# Altium schematic sheet Transmitter.SchDoc
size B; SheetNumber: 1; SheetTotal: 2
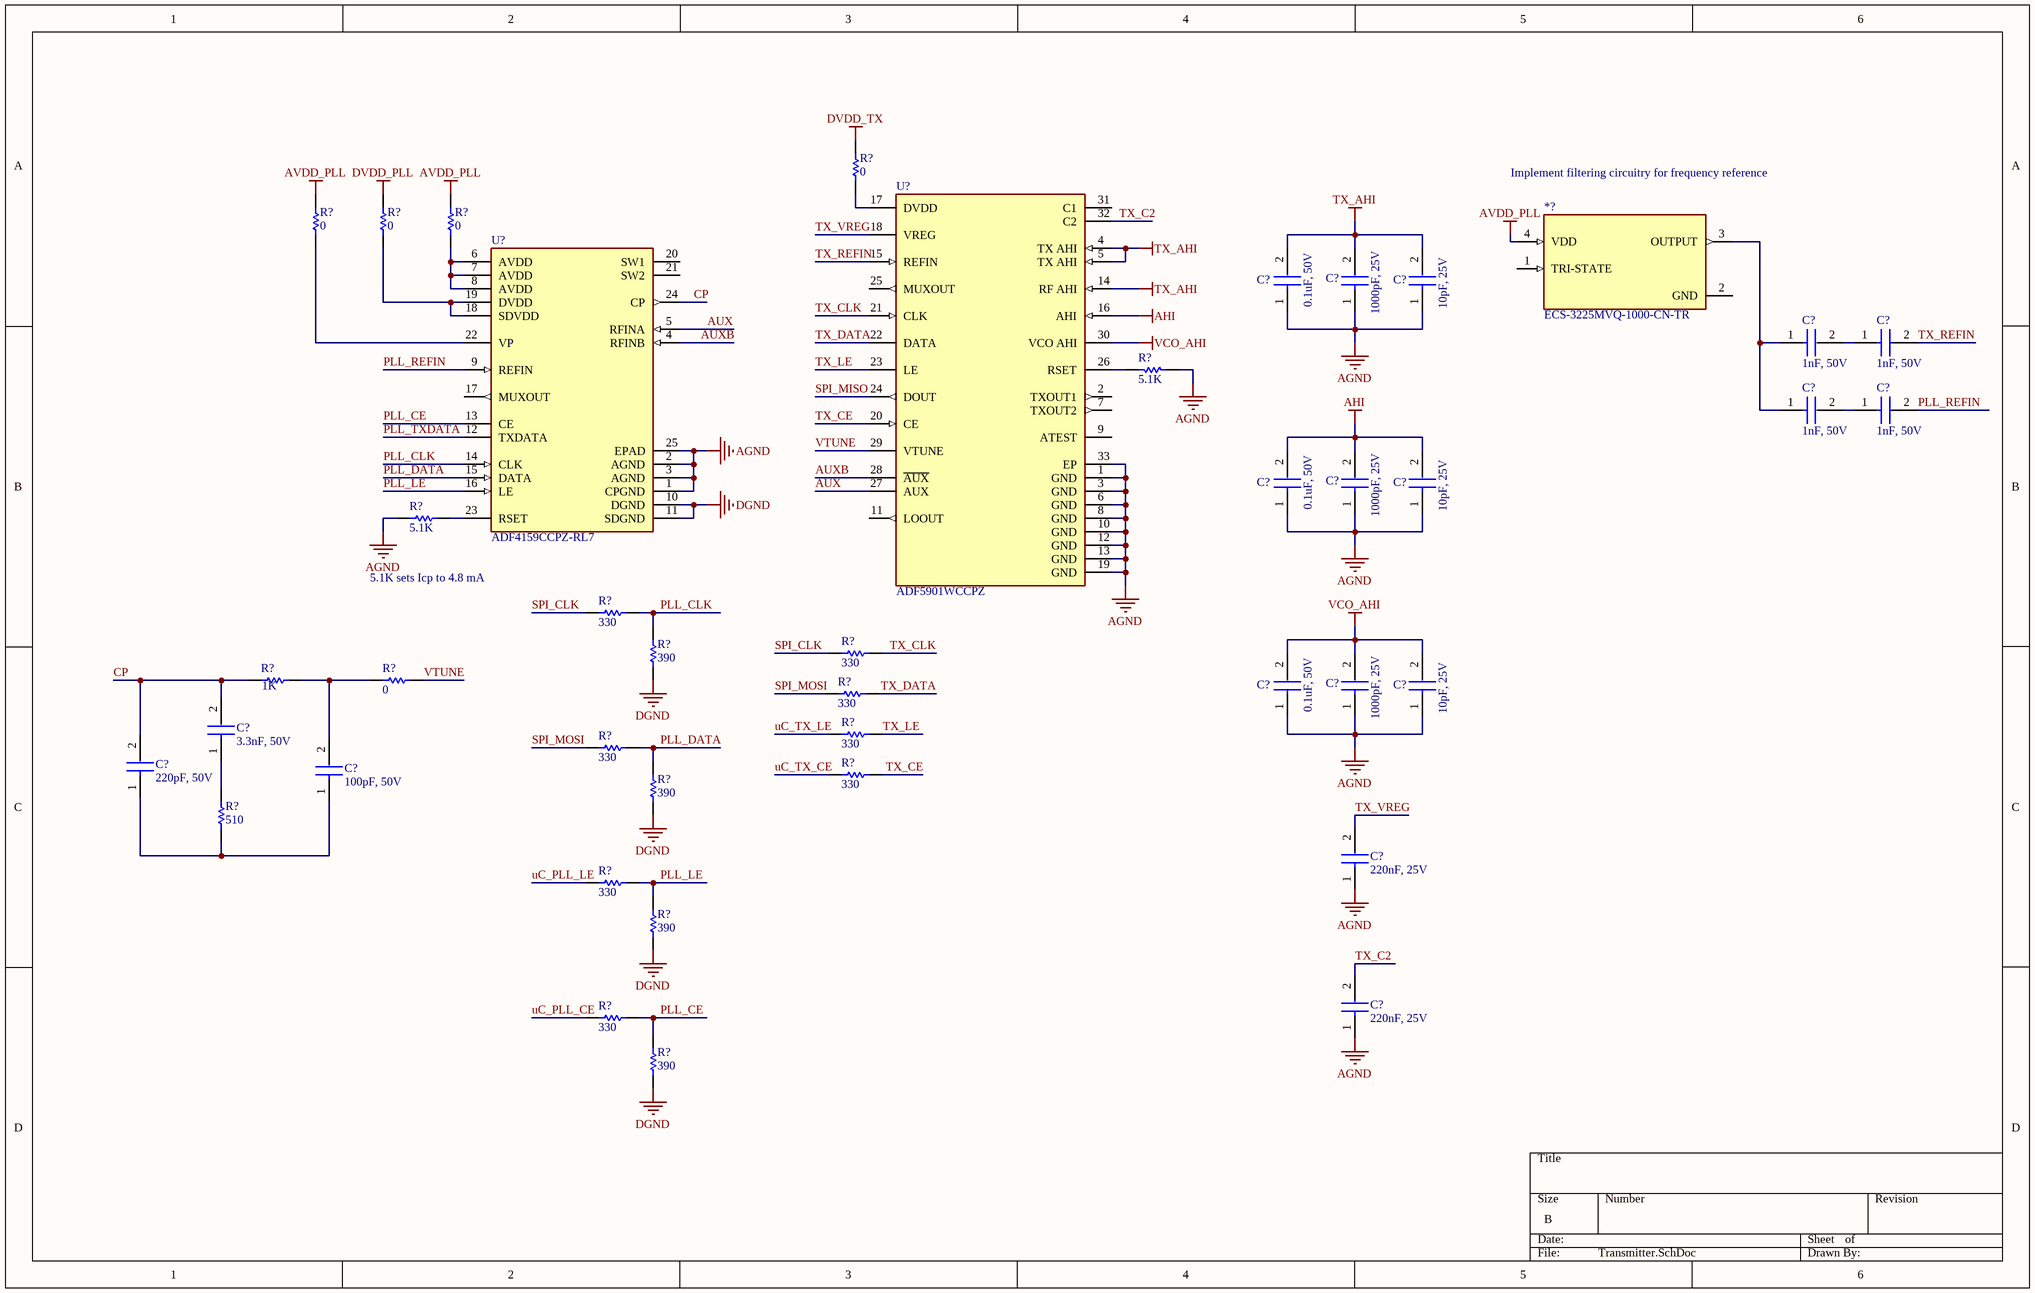
[diagram p0: Transmitter.SchDoc]

## Parts
(Parts that share a designator on the sheet are numbered #1, #2 ... from top to bottom, then left to right.)
*?  ECS-3225MVQ-1000-CN-TR  [OSC_ECS-3225MVQ-1000-CN-TR]
C?#1  0.1uF, 50V  [CAP_CC0603_YAG-M]
C?#2  1000pF, 25V  [FP-0402-L_1_0_1-W_0_5_0_1-IPC_C]
C?#3  10pF, 25V  [CAPC1005X56X25NL10T15]
C?#4  1nF, 50V  [FP-0603-L_1_6_0_15-W_0_81-IPC_C]
C?#5  1nF, 50V  [FP-0603-L_1_6_0_15-W_0_81-IPC_C]
C?#6  1nF, 50V  [FP-0603-L_1_6_0_15-W_0_81-IPC_C]
C?#7  1nF, 50V  [FP-0603-L_1_6_0_15-W_0_81-IPC_C]
C?#8  0.1uF, 50V  [CAP_CC0603_YAG-M]
C?#9  1000pF, 25V  [FP-0402-L_1_0_1-W_0_5_0_1-IPC_C]
C?#10  10pF, 25V  [CAPC1005X56X25NL10T15]
C?#11  0.1uF, 50V  [CAP_CC0603_YAG-M]
C?#12  1000pF, 25V  [FP-0402-L_1_0_1-W_0_5_0_1-IPC_C]
C?#13  10pF, 25V  [CAPC1005X56X25NL10T15]
C?#14  3.3nF, 50V  [CAPC2012X88N]
C?#15  220pF, 50V  [CAPC2012X88N]
C?#16  100pF, 50V  [CAPC2012X88N]
C?#17  220nF, 25V  [FP-0603-L_1_6_0_15-W_0_81-IPC_C]
C?#18  220nF, 25V  [FP-0603-L_1_6_0_15-W_0_81-IPC_C]
R?#1  0  [RESC1005X40X25ML05T05]
R?#2  0  [RESC1005X40X25ML05T05]
R?#3  0  [RESC1005X40X25ML05T05]
R?#4  0  [RESC1005X40X25ML05T05]
R?#5  value 5.1K  (hidden comment: Resistor)
R?#6  value 5.1K  (hidden comment: Resistor)
R?#7  330  [RESC1608X55N]
R?#8  330  [RESC1608X55N]
R?#9  1K  [RESC2012X60N]
R?#10  0  [RES_ERJ-6GEY0R00V]
R?#11  390  [RESC1608X55N]
R?#12  330  [RESC1608X55N]
R?#13  330  [RESC1608X55N]
R?#14  330  [RESC1608X55N]
R?#15  330  [RESC1608X55N]
R?#16  390  [RESC1608X55N]
R?#17  510  [RESC2012X60N]
R?#18  330  [RESC1608X55N]
R?#19  390  [RESC1608X55N]
R?#20  330  [RESC1608X55N]
R?#21  390  [RESC1608X55N]
U?#1  ADF5901WCCPZ
U?#2  ADF4159CCPZ-RL7

## Nets
AGND: C?#1.1 C?#2.1 C?#3.1 C?#8.1 C?#9.1 C?#10.1 C?#11.1 C?#12.1 C?#13.1 C?#17.1 C?#18.1 R?#5.1 R?#6.1 U?#1.1(GND) U?#1.3(GND) U?#1.6(GND) U?#1.8(GND) U?#1.10(GND) U?#1.12(GND) U?#1.13(GND) U?#1.19(GND) U?#1.33(EP) U?#2.1(CPGND) U?#2.2(AGND) U?#2.3(AGND) U?#2.25(EPAD)
AHI: C?#8.2 C?#9.2 C?#10.2 U?#1.16(AHI)
AVDD_PLL: *?.4(VDD) R?#2.2 R?#4.2
DGND: R?#11.1 R?#16.1 R?#19.1 R?#21.1 U?#2.10(DGND) U?#2.11(SDGND)
DVDD_PLL: R?#3.2
DVDD_TX: R?#1.2
TX_AHI: C?#1.2 C?#2.2 C?#3.2 U?#1.4(TX_AHI) U?#1.5(TX_AHI) U?#1.14(RF_AHI)
VCO_AHI: C?#11.2 C?#12.2 C?#13.2 U?#1.30(VCO_AHI)
AUX: U?#1.27(AUX) U?#2.5(RFINA)
AUXB: U?#1.28(~{AUX}) U?#2.4(RFINB)
CP: C?#14.2 C?#15.2 R?#9.1 U?#2.24(CP)
PLL_CE: R?#20.2 R?#21.2 U?#2.13(CE)
PLL_CLK: R?#7.2 R?#11.2 U?#2.14(CLK)
PLL_DATA: R?#14.2 R?#16.2 U?#2.15(DATA)
PLL_LE: R?#18.2 R?#19.2 U?#2.16(LE)
PLL_REFIN: C?#7.2 U?#2.9(REFIN)
PLL_TXDATA: U?#2.12(TXDATA)
SPI_CLK: R?#7.1 R?#8.1
SPI_MISO: U?#1.24(DOUT)
SPI_MOSI: R?#12.1 R?#14.1
TX_C2: C?#18.2 U?#1.32(C2)
TX_CE: R?#15.2 U?#1.20(CE)
TX_CLK: R?#8.2 U?#1.21(CLK)
TX_DATA: R?#12.2 U?#1.22(DATA)
TX_LE: R?#13.2 U?#1.23(LE)
TX_REFIN: C?#5.2 U?#1.15(REFIN)
TX_VREG: C?#17.2 U?#1.18(VREG)
uC_PLL_CE: R?#20.1
uC_PLL_LE: R?#18.1
uC_TX_CE: R?#15.1
uC_TX_LE: R?#13.1
VTUNE: R?#10.2 U?#1.29(VTUNE)
Net*?_3: *?.3(OUTPUT) C?#4.1 C?#6.1
NetC?#4_2: C?#4.2 C?#5.1
NetC?#6_2: C?#6.2 C?#7.1
NetC?#14_1: C?#14.1 R?#17.2
NetC?#15_1: C?#15.1 C?#16.1 R?#17.1
NetC?#16_2: C?#16.2 R?#9.2 R?#10.1
NetR?#1_1: R?#1.1 U?#1.17(DVDD)
NetR?#2_1: R?#2.1 U?#2.22(VP)
NetR?#3_1: R?#3.1 U?#2.18(SDVDD) U?#2.19(DVDD)
NetR?#4_1: R?#4.1 U?#2.6(AVDD) U?#2.7(AVDD) U?#2.8(AVDD)
NetR?#5_2: R?#5.2 U?#1.26(RSET)
NetR?#6_2: R?#6.2 U?#2.23(RSET)

Not connected (* = marked no-connect by the designer): *? 1(TRI-STATE) 2(GND); U?#1 2(TXOUT1) 7(TXOUT2) 9(ATEST) 11(LOOUT) 25(MUXOUT) 31(C1); U?#2 17(MUXOUT) 20(SW1) 21(SW2)

## Notes on the sheet
- Implement filtering circuitry for frequency reference
- 5.1K sets Icp to 4.8 mA

## Library data of the parts
*? = ECS-3225MVQ-1000-CN-TR: CMOS Output Clock Oscillator, 100MHz Nom; Manufacturer: ECS International; Supplier: Digikey; Supplier Part Number: 50-ECS-3225MVQ-1000-CN-CT-ND; Manufacturer Part Number: ECS-3225MVQ-1000-CN-TR; RoHS: Yes; Category: Oscillators; Stock: 9315; Pricing: 1=1.45, 10=1.264, 50=1.146, 100=1.0986, 500=0.99596 (USD); ComponentLink1URL: https://datasheet.octopart.com/ECS-3225MVQ-1000-CN-TR-ECS-International-datasheet-164298191.pdf?src-supplier=Master+Electronics; ComponentLink1Description: https://datasheet.octopart.com/ECS-3225MVQ-1000-CN-TR-ECS-International-datasheet-164298191.pdf?src-supplier=Master+Electronics
C?#1 C?#8 C?#11 = CC0603JRX7R9BB104: Ceramic Capacitor, Multilayer, Ceramic, 50V, 5% +Tol, 5% -Tol, X7R, 15% TC, 0.1uF, Surface Mount, 0603; Manufacturer: Yageo; Value: 100nF; Multilayer: Yes; Supplier: Digikey; Supplier Part Number: 311-1779-1-ND; Manufacturer Part Number: CC0603JRX7R9BB104; RoHS: Yes; Category: Ceramic Capacitors; Stock: 91480; Pricing: 1=0.1, 10=0.05, 100=0.0297, 1000=0.01795 (USD); Mounting Technology: Surface Mount; Pins: 2; Dielectric Material: Ceramic; Package Shape: Rectangular; Case/Package: 0603; Terminal Finish: Nickel; Min Operating Temperature: -55°C; Max Operating Temperature: 125°C; JESD-609 Code: e3; Capacitor Type: Ceramic; Tolerance  (fill in as +-): 5%; Package Style: SMTMeter; Packaging: Tape and Reel; Tolerance (fill in as +-): 5%; Rated DC Voltage (URdc): 50V; Temperature Characteristics Code: X7R; Termination: Wraparound; Length: 1.6mm; Width: 0.8mm; Height: 0.8mm; Reach SVHC Compliant: Yes; RoHS Compliant: Yes; ComponentLink1URL: https://datasheet.ciiva.com:443/pdfs/VipMasterIC/IC/YAGO/YAGO-S-A0003557223/YAGO-S-A0003557223-1.pdf?src-supplier=IHS+Markit; ComponentLink1Description: https://datasheet.ciiva.com:443/pdfs/VipMasterIC/IC/YAGO/YAGO-S-A0003557223/YAGO-S-A0003557223-1.pdf?src-supplier=IHS+Markit; ComponentLink2URL: https://datasheet.ciiva.com/11465/upy-gphc-x7r-6-3v-to-50v-8-11465038.pdf?src-supplier=Avnet; ComponentLink2Description: https://datasheet.ciiva.com/11465/upy-gphc-x7r-6-3v-to-50v-8-11465038.pdf?src-supplier=Avnet
C?#2 C?#9 C?#12 = 04023C102KAT2A: Ceramic Capacitor, Multilayer, Ceramic, 25V, 10% +Tol, 10% -Tol, X7R, 15% TC, 0.001uF, Surface Mount, 0402; Manufacturer: Kyocera AVX; Value: 1nF; Multilayer: Yes; Supplier: Avnet; Supplier Part Number: 94W2836; Manufacturer Part Number: 04023C102KAT2A; RoHS: Yes; Category: Ceramic Capacitors; Stock: 13496; Pricing: 1=0.27, 25=0.179, 100=0.101, 250=0.089, 500=0.077 (USD); Mounting Technology: Surface Mount; Pins: 2; Dielectric Material: Ceramic; Package Shape: Rectangular; Case/Package: 0402; Terminal Finish: Nickel; Min Operating Temperature: -55°C; Max Operating Temperature: 125°C; JESD-609 Code: e3; Capacitor Type: Ceramic; Tolerance  (fill in as +-): 10%; Package Style: SMTMeter; Packaging: Tape and Reel; Tolerance (fill in as +-): 10%; Rated DC Voltage (URdc): 25V; Temperature Characteristics Code: X7R; Termination: Wraparound; Length: 1mm; Width: 0.5mm; Height: 0.56mm; Reach SVHC Compliant: Yes; RoHS Compliant: Yes; ComponentLink1URL: https://datasheet.ciiva.com:443/pdfs/VipMasterIC/IC/AVXC/AVXC-S-A0009640452/AVXC-S-A0009640452-1.pdf?src-supplier=IHS+Markit; ComponentLink1Description: https://datasheet.ciiva.com:443/pdfs/VipMasterIC/IC/AVXC/AVXC-S-A0009640452/AVXC-S-A0009640452-1.pdf?src-supplier=IHS+Markit; ComponentLink2URL: https://datasheet.ciiva.com/150/cx7r-150269.pdf?src-supplier=Digikey; ComponentLink2Description: https://datasheet.ciiva.com/150/cx7r-150269.pdf?src-supplier=Digikey; ComponentLink3URL: https://datasheet.ciiva.com/150/cx7r-150270.pdf?src-supplier=Digikey; ComponentLink3Description: https://datasheet.ciiva.com/150/cx7r-150270.pdf?src-supplier=Digikey; ComponentLink4URL: https://datasheet.ciiva.com/150/cx7r-150271.pdf?src-supplier=Digikey; ComponentLink4Description: https://datasheet.ciiva.com/150/cx7r-150271.pdf?src-supplier=Digikey; ComponentLink5URL: https://datasheet.ciiva.com/5416/cx7r-218113-5416554.pdf?src-supplier=Mouser; ComponentLink5Description: https://datasheet.ciiva.com/5416/cx7r-218113-5416554.pdf?src-supplier=Mouser; ComponentLink6URL: https://datasheet.ciiva.com/22619/1679506-22619707.pdf?src-supplier=Element14; ComponentLink6Description: https://datasheet.ciiva.com/22619/1679506-22619707.pdf?src-supplier=Element14; ComponentLink7URL: https://datasheet.ciiva.com/16395/cx7r-16395543.pdf?src-supplier=Future+Electronics; ComponentLink7Description: https://datasheet.ciiva.com/16395/cx7r-16395543.pdf?src-supplier=Future+Electronics; ComponentLink8URL: https://datasheet.ciiva.com/28453/1679506-28453691.pdf?src-supplier=Element14; ComponentLink8Description: https://datasheet.ciiva.com/28453/1679506-28453691.pdf?src-supplier=Element14
C?#3 C?#10 C?#13 = 04023A100CAT2A: Ceramic Capacitor, Multilayer, Ceramic, 25V, 2.5% +Tol, 2.5% -Tol, C0G, -/+30ppm/Cel TC, 0.00001uF, Surface Mount, 0402; Manufacturer: Kyocera AVX; Multilayer: Yes; Supplier: Digikey; Supplier Part Number: 478-12605-1-ND; Manufacturer Part Number: 04023A100CAT2A; RoHS: Yes; Category: Ceramic Capacitors; Stock: 37135; Pricing: 1=0.1, 10=0.031, 100=0.0176, 1000=0.01095, 2500=0.00932, 5000=0.00834 (USD); Mounting Technology: Surface Mount; Pins: 2; Dielectric Material: Ceramic; Package Shape: Rectangular; Case/Package: 0402; Terminal Finish: Nickel; Min Operating Temperature: -55°C; Max Operating Temperature: 125°C; JESD-609 Code: e3; Value: 10pF; Capacitor Type: Ceramic; Tolerance  (fill in as +-): 2.5%; Package Style: SMTMeter; Packaging: Tape and Reel; Tolerance (fill in as +-): 2.5%; Rated DC Voltage (URdc): 25V; Temperature Characteristics Code: C0G; Termination: Wraparound; Length: 1mm; Width: 0.5mm; Height: 0.56mm; Reach SVHC Compliant: Yes; RoHS Compliant: Yes; ComponentLink1URL: https://datasheet.ciiva.com:443/pdfs/VipMasterIC/IC/AVXC/AVXCS08560/AVXCS08560-1.pdf?src-supplier=IHS+Markit; ComponentLink1Description: https://datasheet.ciiva.com:443/pdfs/VipMasterIC/IC/AVXC/AVXCS08560/AVXCS08560-1.pdf?src-supplier=IHS+Markit; ComponentLink2URL: https://datasheet.ciiva.com/206/ccog-206334.pdf?src-supplier=Digikey; ComponentLink2Description: https://datasheet.ciiva.com/206/ccog-206334.pdf?src-supplier=Digikey; ComponentLink3URL: https://datasheet.ciiva.com/11519/ccog-11519270.pdf?src-supplier=Avnet; ComponentLink3Description: https://datasheet.ciiva.com/11519/ccog-11519270.pdf?src-supplier=Avnet; ComponentLink4URL: https://datasheet.ciiva.com/5419/ccog-5419960.pdf?src-supplier=Mouser; ComponentLink4Description: https://datasheet.ciiva.com/5419/ccog-5419960.pdf?src-supplier=Mouser; ComponentLink5URL: https://datasheet.ciiva.com/15212/getdatasheetpartid-659848-15212012.pdf?src-supplier=Verical; ComponentLink5Description: https://datasheet.ciiva.com/15212/getdatasheetpartid-659848-15212012.pdf?src-supplier=Verical
C?#4-C?#7 = 06035A102JAT2A: Ceramic Capacitor, Multilayer, Ceramic, 50V, 5% +Tol, 5% -Tol, C0G, 30ppm/Cel TC, 0.001uF, Surface Mount, 0603; Manufacturer: Kyocera AVX; Multilayer: Yes; Supplier: Avnet; Supplier Part Number: KGM15ACG1H102JT; Manufacturer Part Number: 06035A102JAT2A; RoHS: Yes; Category: Ceramic Capacitors; Stock: 540000; Pricing: 4000=0.00488, 8000=0.00454, 16000=0.00447, 24000=0.00439, 32000=0.00431 (USD); Mounting Technology: Surface Mount; Pins: 2; Dielectric Material: Ceramic; Package Shape: Rectangular; Case/Package: 0603; Terminal Finish: Nickel; Min Operating Temperature: -55°C; Max Operating Temperature: 125°C; JESD-609 Code: e3; Value: 1nF; Capacitor Type: Ceramic; Tolerance  (fill in as +-): 5%; Package Style: SMTMeter; Packaging: Tape and Reel; Tolerance (fill in as +-): 5%; Rated DC Voltage (URdc): 50V; Temperature Characteristics Code: C0G; Termination: Wraparound; Length: 1.6mm; Width: 0.81mm; Height: 0.9mm; RoHS Compliant: Yes; Reach SVHC Compliant: Yes; ComponentLink1URL: https://datasheet.ciiva.com:443/pdfs/VipMasterIC/IC/AVXC/AVXC-S-A0008899940/AVXC-S-A0008899940-1.pdf?src-supplier=IHS+Markit; ComponentLink1Description: https://datasheet.ciiva.com:443/pdfs/VipMasterIC/IC/AVXC/AVXC-S-A0008899940/AVXC-S-A0008899940-1.pdf?src-supplier=IHS+Markit; ComponentLink2URL: https://datasheet.ciiva.com/11786/0900766b802d4697-11786950.pdf?src-supplier=Rs; ComponentLink2Description: https://datasheet.ciiva.com/11786/0900766b802d4697-11786950.pdf?src-supplier=Rs; ComponentLink3URL: https://datasheet.ciiva.com/11464/ccog-11464573.pdf?src-supplier=Avnet; ComponentLink3Description: https://datasheet.ciiva.com/11464/ccog-11464573.pdf?src-supplier=Avnet; ComponentLink4URL: https://datasheet.ciiva.com/16363/ccog-16363640.pdf?src-supplier=Future+Electronics; ComponentLink4Description: https://datasheet.ciiva.com/16363/ccog-16363640.pdf?src-supplier=Future+Electronics; ComponentLink5URL: https://datasheet.ciiva.com/1124/759117-1124717.pdf?src-supplier=Element14; ComponentLink5Description: https://datasheet.ciiva.com/1124/759117-1124717.pdf?src-supplier=Element14; ComponentLink6URL: https://datasheet.ciiva.com/1124/759117-1124716.pdf?src-supplier=Element14; ComponentLink6Description: https://datasheet.ciiva.com/1124/759117-1124716.pdf?src-supplier=Element14; ComponentLink7URL: https://datasheet.ciiva.com/1466/26712-1466099.pdf?src-supplier=Farnell; ComponentLink7Description: https://datasheet.ciiva.com/1466/26712-1466099.pdf?src-supplier=Farnell; ComponentLink8URL: https://datasheet.ciiva.com/1124/26712-1124715.pdf?src-supplier=Element14; ComponentLink8Description: https://datasheet.ciiva.com/1124/26712-1124715.pdf?src-supplier=Element14; ComponentLink9URL: https://datasheet.ciiva.com/150/ccog-150886.pdf?src-supplier=Digikey; ComponentLink9Description: https://datasheet.ciiva.com/150/ccog-150886.pdf?src-supplier=Digikey; ComponentLink10URL: https://datasheet.ciiva.com/150/ccog-150885.pdf?src-supplier=Digikey; ComponentLink10Description: https://datasheet.ciiva.com/150/ccog-150885.pdf?src-supplier=Digikey; ComponentLink11URL: https://datasheet.ciiva.com/150/ccog-150887.pdf?src-supplier=Digikey; ComponentLink11Description: https://datasheet.ciiva.com/150/ccog-150887.pdf?src-supplier=Digikey; ComponentLink12URL: https://datasheet.ciiva.com/14585/70001039-14585948.pdf?src-supplier=Allied+Electronics; ComponentLink12Description: https://datasheet.ciiva.com/14585/70001039-14585948.pdf?src-supplier=Allied+Electronics
C?#14 = C0805C332F5GECAUTO7210: Ceramic Capacitor, Multilayer, Ceramic, 50V, 1% +Tol, 1% -Tol, C0G, -/+30ppm/Cel TC, 0.0033uF, Surface Mount, 0805; Manufacturer: KEMET; Supplier: Digikey; Supplier Part Number: 399-C0805C332F5GECAUTO7210CT-ND; Manufacturer Part Number: C0805C332F5GECAUTO7210; RoHS: Yes; Category: Ceramic Capacitors; Stock: 26767; Pricing: 1=1.04, 10=0.667, 100=0.4755, 1000=0.37569, 2500=0.34478, 5000=0.3415 (USD); Pins: 2; Dielectric Material: Ceramic; Capacitor Type: Ceramic; Reach SVHC Compliant: Yes; RoHS Compliant: Yes; ComponentLink1URL: https://datasheet.ciiva.com:443/pdfs/VipMasterIC/IC/KEME/KEME-S-A0008958440/KEME-S-A0008958440-1.pdf?src-supplier=IHS+Markit; ComponentLink1Description: https://datasheet.ciiva.com:443/pdfs/VipMasterIC/IC/KEME/KEME-S-A0008958440/KEME-S-A0008958440-1.pdf?src-supplier=IHS+Markit; ComponentLink2URL: https://api.kemet.com/component-edge/download/datasheet/C0805C332F5GECAUTO7210.pdf?src-supplier=Digikey; ComponentLink2Description: https://api.kemet.com/component-edge/download/datasheet/C0805C332F5GECAUTO7210.pdf?src-supplier=Digikey
C?#15 = C0805C221F5GACTU: Ceramic Capacitor, Multilayer, Ceramic, 50V, 1% +Tol, 1% -Tol, C0G, -/+30ppm/Cel TC, 0.00022uF, Surface Mount, 0805; Manufacturer: KEMET; Multilayer: Yes; Supplier: Mouser; Supplier Part Number: 80-C0805C221F5G; Manufacturer Part Number: C0805C221F5GACTU; RoHS: Yes; Category: Ceramic Capacitors; Stock: 5633; Pricing: 1=0.72, 10=0.486, 50=0.486, 100=0.319, 1000=0.3, 10000=0.241 (USD); Mounting Technology: Surface Mount; Pins: 2; Dielectric Material: Ceramic; Package Shape: Rectangular; Case/Package: 0805; Terminal Finish: Nickel; Min Operating Temperature: -55°C; Max Operating Temperature: 125°C; JESD-609 Code: e3; Value: 220pF; Capacitor Type: Ceramic; Manufacturer Series: C0805C221F5GACTU; Tolerance  (fill in as +-): 1%; Packaging: Tape and Reel; Tolerance (fill in as +-): 1%; Rated DC Voltage (URdc): 50V; Temperature Characteristics Code: C0G; Termination: Wraparound; Reach SVHC Compliant: Yes; RoHS Compliant: Yes; ComponentLink1URL: http://capacitoredge.kemet.com:80/capedge2/DataSheet/Datasheet-C0805C221F5GAC7800.pdf?pn=C0805C221F5GAC7800&src-supplier=IHS+Markit; ComponentLink1Description: http://capacitoredge.kemet.com:80/capedge2/DataSheet/Datasheet-C0805C221F5GAC7800.pdf?pn=C0805C221F5GAC7800&src-supplier=IHS+Markit; ComponentLink2URL: https://datasheet.ciiva.com/5421/kem-c1003-c0g-smd-5421884.pdf?src-supplier=Mouser; ComponentLink2Description: https://datasheet.ciiva.com/5421/kem-c1003-c0g-smd-5421884.pdf?src-supplier=Mouser
C?#16 = C0805C101F5GACTU: Ceramic Capacitor, Multilayer, Ceramic, 50V, 1% +Tol, 1% -Tol, C0G, -/+30ppm/Cel TC, 0.0001uF, Surface Mount, 0805; Manufacturer: KEMET; Multilayer: Yes; Supplier: Mouser; Supplier Part Number: 80-C0805C101F5G; Manufacturer Part Number: C0805C101F5GACTU; RoHS: Yes; Category: Ceramic Capacitors; Stock: 3581; Pricing: 1=0.65, 10=0.432, 50=0.432, 100=0.26, 1000=0.193, 10000=0.151 (USD); Mounting Technology: Surface Mount; Pins: 2; Dielectric Material: Ceramic; Package Shape: Rectangular; Case/Package: 0805; Terminal Finish: Nickel; Min Operating Temperature: -55°C; Max Operating Temperature: 125°C; JESD-609 Code: e3; Value: 100pF; Capacitor Type: Ceramic; Tolerance  (fill in as +-): 1%; Packaging: Tape and Reel; Tolerance (fill in as +-): 1%; Rated DC Voltage (URdc): 50V; Temperature Characteristics Code: C0G; Termination: Wraparound; Reach SVHC Compliant: Yes; RoHS Compliant: Yes; ComponentLink1URL: https://datasheet.ciiva.com:443/pdfs/VipMasterIC/IC/KEME/KEME-S-A0003149333/KEME-S-A0003149333-1.pdf?src-supplier=IHS+Markit; ComponentLink1Description: https://datasheet.ciiva.com:443/pdfs/VipMasterIC/IC/KEME/KEME-S-A0003149333/KEME-S-A0003149333-1.pdf?src-supplier=IHS+Markit; ComponentLink2URL: https://datasheet.ciiva.com/5417/kem-c1003-c0g-smd-356956-5417147.pdf?src-supplier=Mouser; ComponentLink2Description: https://datasheet.ciiva.com/5417/kem-c1003-c0g-smd-356956-5417147.pdf?src-supplier=Mouser; ComponentLink3URL: https://datasheet.ciiva.com/11630/kem-c1003-c0g-smd-11630821.pdf?src-supplier=Avnet; ComponentLink3Description: https://datasheet.ciiva.com/11630/kem-c1003-c0g-smd-11630821.pdf?src-supplier=Avnet
C?#17 C?#18 = 06033C224KAT2A: Ceramic Capacitor, Multilayer, Ceramic, 25V, 10% +Tol, 10% -Tol, X7R, 15% TC, 0.22uF, Surface Mount, 0603; Manufacturer: Kyocera AVX; Multilayer: Yes; Supplier: Mouser; Supplier Part Number: 581-06033C224KAT2A; Manufacturer Part Number: 06033C224KAT2A; RoHS: Yes; Category: Ceramic Capacitors; Stock: 50562; Pricing: 1=0.27, 10=0.264, 50=0.264, 100=0.254, 1000=0.254, 10000=0.239 (USD); Mounting Technology: Surface Mount; Pins: 2; Dielectric Material: Ceramic; Package Shape: Rectangular; Case/Package: 0603; Terminal Finish: Nickel; Min Operating Temperature: -55°C; Max Operating Temperature: 125°C; JESD-609 Code: e3; Value: 220nF; Capacitor Type: Ceramic; Tolerance  (fill in as +-): 10%; Package Style: SMTMeter; Packaging: Tape and Reel; Tolerance (fill in as +-): 10%; Rated DC Voltage (URdc): 25V; Temperature Characteristics Code: X7R; Termination: Wraparound; Length: 1.6mm; Width: 0.81mm; Height: 0.94mm; Reach SVHC Compliant: Yes; RoHS Compliant: Yes; ComponentLink1URL: https://datasheet.ciiva.com:443/pdfs/VipMasterIC/IC/AVXC/AVXC-S-A0009640452/AVXC-S-A0009640452-1.pdf?src-supplier=IHS+Markit; ComponentLink1Description: https://datasheet.ciiva.com:443/pdfs/VipMasterIC/IC/AVXC/AVXC-S-A0009640452/AVXC-S-A0009640452-1.pdf?src-supplier=IHS+Markit; ComponentLink2URL: https://datasheet.ciiva.com/11557/cx7r-11557469.pdf?src-supplier=Avnet; ComponentLink2Description: https://datasheet.ciiva.com/11557/cx7r-11557469.pdf?src-supplier=Avnet; ComponentLink3URL: https://datasheet.ciiva.com/1124/1679506-1124598.pdf?src-supplier=Element14; ComponentLink3Description: https://datasheet.ciiva.com/1124/1679506-1124598.pdf?src-supplier=Element14; ComponentLink4URL: https://datasheet.ciiva.com/22700/1679506-22700567.pdf?src-supplier=Element14; ComponentLink4Description: https://datasheet.ciiva.com/22700/1679506-22700567.pdf?src-supplier=Element14; ComponentLink5URL: https://datasheet.ciiva.com/15212/getdatasheetpartid-224009-15212215.pdf?src-supplier=Verical; ComponentLink5Description: https://datasheet.ciiva.com/15212/getdatasheetpartid-224009-15212215.pdf?src-supplier=Verical; ComponentLink6URL: https://datasheet.ciiva.com/7855/1679506-7855048.pdf?src-supplier=Element14; ComponentLink6Description: https://datasheet.ciiva.com/7855/1679506-7855048.pdf?src-supplier=Element14
R?#1-R?#4 = ERJ-3GEY0R00V: Fixed Resistor, Metal Glaze/thick Film, 0.1W, 0ohm, Surface Mount, 0603; Manufacturer: Panasonic; Power: 100mW; Rated Temperature: 70°C; Value: 0R; Package Height: 0.45mm; Package Length: 1.6mm; Package Width: 0.8mm; Reference Standard: AEC-Q200; Supplier: Digikey; Supplier Part Number: P0.0GCT-ND; Manufacturer Part Number: ERJ-3GEY0R00V; RoHS: Yes; Category: Chip SMD Resistors; Stock: 690397; Pricing: 1=0.1, 10=0.02, 25=0.0164, 50=0.0144, 100=0.0126, 250=0.0106, 500=0.00936, 1000=0.0083, 5000=0.0064, 10000=0.00578, 15000=0.00546, 25000=0.0051, 35000=0.00489, 50000=0.00468, 125000=0.00421, 250000=0.00392, 500000=0.00367 (USD); Mounting Technology: Surface Mount; Pins: 2; Package Shape: Rectangular; Case/Package: 0603; Terminal Finish: Nickel; Min Operating Temperature: -55°C; Max Operating Temperature: 155°C; JESD-609 Code: e3; Resistor Type: FIXED RESISTOR; Construction: Rectangular; Packaging: Tape and Reel; Technology: METAL GLAZE/THICK FILM; Termination: Wraparound; Reach SVHC Compliant: Yes; RoHS Compliant: Yes; ComponentLink1URL: https://datasheet.ciiva.com:443/pdfs/VipMasterIC/IC/PANA/PANA-S-A0009459603/PANA-S-A0009459603-1.pdf?src-supplier=IHS+Markit; ComponentLink1Description: https://datasheet.ciiva.com:443/pdfs/VipMasterIC/IC/PANA/PANA-S-A0009459603/PANA-S-A0009459603-1.pdf?src-supplier=IHS+Markit; ComponentLink2URL: https://datasheet.ciiva.com/11808/0900766b80f806dd-11808207.pdf?src-supplier=Rs; ComponentLink2Description: https://datasheet.ciiva.com/11808/0900766b80f806dd-11808207.pdf?src-supplier=Rs; ComponentLink3URL: https://datasheet.ciiva.com/27055/1935748-27055113.pdf?src-supplier=Jameco; ComponentLink3Description: https://datasheet.ciiva.com/27055/1935748-27055113.pdf?src-supplier=Jameco; ComponentLink4URL: https://datasheet.ciiva.com/43460/1678796-43460647.pdf?src-supplier=Farnell; ComponentLink4Description: https://datasheet.ciiva.com/43460/1678796-43460647.pdf?src-supplier=Farnell; ComponentLink5URL: https://datasheet.ciiva.com/28695/1678796-28695833.pdf?src-supplier=Element14; ComponentLink5Description: https://datasheet.ciiva.com/28695/1678796-28695833.pdf?src-supplier=Element14; ComponentLink6URL: https://datasheet.ciiva.com/5959/1678796-5959707.pdf?src-supplier=Farnell; ComponentLink6Description: https://datasheet.ciiva.com/5959/1678796-5959707.pdf?src-supplier=Farnell; ComponentLink7URL: https://datasheet.ciiva.com/48532/aoa0000ce1-48532165.pdf?src-supplier=Avnet; ComponentLink7Description: https://datasheet.ciiva.com/48532/aoa0000ce1-48532165.pdf?src-supplier=Avnet; ComponentLink8URL: https://datasheet.ciiva.com/30199/4aoa0000ce1-30199822.pdf?src-supplier=Onlinecomponents.com; ComponentLink8Description: https://datasheet.ciiva.com/30199/4aoa0000ce1-30199822.pdf?src-supplier=Onlinecomponents.com; ComponentLink9URL: https://datasheet.ciiva.com/16834/aoa0000ce1-16834828.pdf?src-supplier=Future+Electronics; ComponentLink9Description: https://datasheet.ciiva.com/16834/aoa0000ce1-16834828.pdf?src-supplier=Future+Electronics; ComponentLink10URL: https://datasheet.ciiva.com/16758/70255313-16758527.pdf?src-supplier=Allied+Electronics; ComponentLink10Description: https://datasheet.ciiva.com/16758/70255313-16758527.pdf?src-supplier=Allied+Electronics; ComponentLink11URL: https://datasheet.ciiva.com/46377/1678796-46377868.pdf?src-supplier=Element14; ComponentLink11Description: https://datasheet.ciiva.com/46377/1678796-46377868.pdf?src-supplier=Element14; ComponentLink12URL: https://datasheet.ciiva.com/9198/aoa0000ce1-9198975.pdf?src-supplier=Avnet; ComponentLink12Description: https://datasheet.ciiva.com/9198/aoa0000ce1-9198975.pdf?src-supplier=Avnet
R?#5 R?#6 = Resistor: TC1: 0; SimulationGenericComponent: True; TC2: 0
R?#7 R?#8 R?#12-R?#15 R?#18 R?#20 = RC0603JR-07330RL: Fixed Resistor, Metal Glaze/thick Film, 0.1W, 330ohm, 75V, 5% +/-Tol, 100ppm/Cel, Surface Mount, 0603; Manufacturer: Yageo; Additional Feature: LASER TRIMMABLE; Power: 100mW; Rated Temperature: 70°C; Value: 330R; Temperature Coefficient (ppm/Cel): 100; Package Height: 0.45mm; Package Length: 1.6mm; Package Width: 0.8mm; Supplier: Digikey; Supplier Part Number: 311-330GRCT-ND; Manufacturer Part Number: RC0603JR-07330RL; RoHS: Yes; Category: Chip SMD Resistors; Stock: 1855359; Pricing: 1=0.1, 10=0.006, 50=0.0056, 100=0.0051, 500=0.00502 (USD); Mounting Technology: Surface Mount; Pins: 2; Package Shape: Rectangular; Case/Package: 0603; Terminal Finish: Nickel; Min Operating Temperature: -55°C; Max Operating Temperature: 155°C; Tolerance: 5%; JESD-609 Code: e3; Resistor Type: FIXED RESISTOR; Construction: Chip; Packaging: Tape and Reel; Technology: METAL GLAZE/THICK FILM; Termination: Wraparound; Working Voltage: 75V; Reach SVHC Compliant: Yes; RoHS Compliant: Yes; ComponentLink1URL: https://datasheet.ciiva.com:443/pdfs/VipMasterIC/IC/YAGO/YAGO-S-A0008145938/YAGO-S-A0008145938-1.pdf?src-supplier=IHS+Markit; ComponentLink1Description: https://datasheet.ciiva.com:443/pdfs/VipMasterIC/IC/YAGO/YAGO-S-A0008145938/YAGO-S-A0008145938-1.pdf?src-supplier=IHS+Markit; ComponentLink2URL: https://datasheet.ciiva.com/7746/1868787-7746487.pdf?src-supplier=Element14; ComponentLink2Description: https://datasheet.ciiva.com/7746/1868787-7746487.pdf?src-supplier=Element14; ComponentLink3URL: https://datasheet.ciiva.com/7746/443971-7746488.pdf?src-supplier=Element14; ComponentLink3Description: https://datasheet.ciiva.com/7746/443971-7746488.pdf?src-supplier=Element14; ComponentLink4URL: https://datasheet.ciiva.com/46395/443971-46395145.pdf?src-supplier=Element14; ComponentLink4Description: https://datasheet.ciiva.com/46395/443971-46395145.pdf?src-supplier=Element14; ComponentLink5URL: https://datasheet.ciiva.com/12558/rc0603-272842-12558685.pdf?src-supplier=Mouser; ComponentLink5Description: https://datasheet.ciiva.com/12558/rc0603-272842-12558685.pdf?src-supplier=Mouser
R?#9 = RC0805FR-071KL: Fixed Resistor, Metal Glaze/thick Film, 0.125W, 1000ohm, 150V, 1% +/-Tol, 100ppm/Cel, Surface Mount, 0805; Manufacturer: Yageo; Additional Feature: LASER TRIMMABLE; Power: 125mW; Rated Temperature: 70°C; Value: 1kR; Temperature Coefficient (ppm/Cel): 100; Package Height: 0.5mm; Package Length: 2mm; Package Width: 1.25mm; Supplier: Digikey; Supplier Part Number: 311-1.00KCRCT-ND; Manufacturer Part Number: RC0805FR-071KL; RoHS: Yes; Category: Chip SMD Resistors; Stock: 614745; Pricing: 1=0.1, 10=0.012, 100=0.0112, 1000=0.00714 (USD); Mounting Technology: Surface Mount; Pins: 2; Package Shape: Rectangular; Case/Package: 0805; Terminal Finish: Nickel; Min Operating Temperature: -55°C; Max Operating Temperature: 155°C; Tolerance: 1%; JESD-609 Code: e3; Termination: Wraparound; Resistor Type: FIXED RESISTOR; Construction: Chip; Packaging: Tape and Reel; Technology: METAL GLAZE/THICK FILM; Working Voltage: 150V; Reach SVHC Compliant: Yes; RoHS Compliant: Yes; ComponentLink1URL: https://datasheet.ciiva.com:443/pdfs/VipMasterIC/IC/YAGO/YAGO-S-A0008145938/YAGO-S-A0008145938-1.pdf?src-supplier=IHS+Markit; ComponentLink1Description: https://datasheet.ciiva.com:443/pdfs/VipMasterIC/IC/YAGO/YAGO-S-A0008145938/YAGO-S-A0008145938-1.pdf?src-supplier=IHS+Markit; ComponentLink2URL: https://datasheet.ciiva.com/7941/1686128-7941719.pdf?src-supplier=Element14; ComponentLink2Description: https://datasheet.ciiva.com/7941/1686128-7941719.pdf?src-supplier=Element14; ComponentLink3URL: https://datasheet.ciiva.com/2456/pyu-r-int-thick-7-2456976.pdf?src-supplier=Digikey; ComponentLink3Description: https://datasheet.ciiva.com/2456/pyu-r-int-thick-7-2456976.pdf?src-supplier=Digikey; ComponentLink4URL: https://datasheet.ciiva.com/2456/pyu-r-int-thick-7-2456977.pdf?src-supplier=Digikey; ComponentLink4Description: https://datasheet.ciiva.com/2456/pyu-r-int-thick-7-2456977.pdf?src-supplier=Digikey; ComponentLink5URL: https://datasheet.ciiva.com/2456/pyu-r-int-thick-7-2456975.pdf?src-supplier=Digikey; ComponentLink5Description: https://datasheet.ciiva.com/2456/pyu-r-int-thick-7-2456975.pdf?src-supplier=Digikey
R?#10 = ERJ-6GEY0R00V: Fixed Resistor, Metal Glaze/thick Film, 0.125W, 0ohm, Surface Mount, 0805; Manufacturer: Panasonic; Power: 125mW; Rated Temperature: 70°C; Value: 0R; Package Height: 0.6mm; Package Length: 2mm; Package Width: 1.25mm; Reference Standard: AEC-Q200; Supplier: Digikey; Supplier Part Number: P0.0ACT-ND; Manufacturer Part Number: ERJ-6GEY0R00V; RoHS: Yes; Category: Chip SMD Resistors; Stock: 3178323; Pricing: 1=0.1, 10=0.028, 25=0.0236, 50=0.0204, 100=0.0179, 250=0.01516, 500=0.01342, 1000=0.01193 (USD); Mounting Technology: Surface Mount; Pins: 2; Package Shape: Rectangular; Case/Package: 0805; Terminal Finish: Nickel; Min Operating Temperature: -55°C; Max Operating Temperature: 155°C; JESD-609 Code: e3; Resistor Type: FIXED RESISTOR; Construction: Rectangular; Packaging: Tape and Reel; Technology: METAL GLAZE/THICK FILM; Termination: Wraparound; Reach SVHC Compliant: Yes; RoHS Compliant: Yes; ComponentLink1URL: https://datasheet.ciiva.com:443/pdfs/VipMasterIC/IC/PANA/PANA-S-A0009459603/PANA-S-A0009459603-1.pdf?src-supplier=IHS+Markit; ComponentLink1Description: https://datasheet.ciiva.com:443/pdfs/VipMasterIC/IC/PANA/PANA-S-A0009459603/PANA-S-A0009459603-1.pdf?src-supplier=IHS+Markit; ComponentLink2URL: https://datasheet.ciiva.com/11821/0900766b80f806dd-11821735.pdf?src-supplier=Rs; ComponentLink2Description: https://datasheet.ciiva.com/11821/0900766b80f806dd-11821735.pdf?src-supplier=Rs; ComponentLink3URL: https://datasheet.ciiva.com/28695/1678796-28695877.pdf?src-supplier=Element14; ComponentLink3Description: https://datasheet.ciiva.com/28695/1678796-28695877.pdf?src-supplier=Element14; ComponentLink4URL: https://datasheet.ciiva.com/46377/1678796-46377866.pdf?src-supplier=Element14; ComponentLink4Description: https://datasheet.ciiva.com/46377/1678796-46377866.pdf?src-supplier=Element14; ComponentLink5URL: https://datasheet.ciiva.com/43460/1678796-43460073.pdf?src-supplier=Farnell; ComponentLink5Description: https://datasheet.ciiva.com/43460/1678796-43460073.pdf?src-supplier=Farnell; ComponentLink6URL: https://datasheet.ciiva.com/9117/aoa0000ce1-9117354.pdf?src-supplier=Avnet; ComponentLink6Description: https://datasheet.ciiva.com/9117/aoa0000ce1-9117354.pdf?src-supplier=Avnet
R?#11 R?#16 R?#19 R?#21 = RC0603JR-07390RL: Fixed Resistor, Metal Glaze/thick Film, 0.1W, 390ohm, 75V, 5% +/-Tol, 100ppm/Cel, Surface Mount, 0603; Manufacturer: Yageo; Additional Feature: LASER TRIMMABLE; Power: 100mW; Rated Temperature: 70°C; Value: 390R; Temperature Coefficient (ppm/Cel): 100; Package Height: 0.45mm; Package Length: 1.6mm; Package Width: 0.8mm; Supplier: Digikey; Supplier Part Number: 311-390GRCT-ND; Manufacturer Part Number: RC0603JR-07390RL; RoHS: Yes; Category: Chip SMD Resistors; Stock: 925566; Pricing: 1=0.1, 10=0.007, 50=0.0066, 100=0.0061, 500=0.0056, 1000=0.0051 (USD); Mounting Technology: Surface Mount; Pins: 2; Package Shape: Rectangular; Case/Package: 0603; Terminal Finish: Nickel; Min Operating Temperature: -55°C; Max Operating Temperature: 155°C; Tolerance: 5%; JESD-609 Code: e3; Resistor Type: FIXED RESISTOR; Construction: Chip; Packaging: Tape and Reel; Technology: METAL GLAZE/THICK FILM; Termination: Wraparound; Working Voltage: 75V; Reach SVHC Compliant: Yes; RoHS Compliant: Yes; ComponentLink1URL: https://datasheet.ciiva.com:443/pdfs/VipMasterIC/IC/YAGO/YAGO-S-A0008145938/YAGO-S-A0008145938-1.pdf?src-supplier=IHS+Markit; ComponentLink1Description: https://datasheet.ciiva.com:443/pdfs/VipMasterIC/IC/YAGO/YAGO-S-A0008145938/YAGO-S-A0008145938-1.pdf?src-supplier=IHS+Markit; ComponentLink2URL: https://datasheet.ciiva.com/2453/pyu-r-int-thick-7-2453109.pdf?src-supplier=Digikey; ComponentLink2Description: https://datasheet.ciiva.com/2453/pyu-r-int-thick-7-2453109.pdf?src-supplier=Digikey; ComponentLink3URL: https://datasheet.ciiva.com/2453/pyu-r-int-thick-7-2453110.pdf?src-supplier=Digikey; ComponentLink3Description: https://datasheet.ciiva.com/2453/pyu-r-int-thick-7-2453110.pdf?src-supplier=Digikey; ComponentLink4URL: https://datasheet.ciiva.com/2453/pyu-r-int-thick-7-2453111.pdf?src-supplier=Digikey; ComponentLink4Description: https://datasheet.ciiva.com/2453/pyu-r-int-thick-7-2453111.pdf?src-supplier=Digikey; ComponentLink5URL: https://datasheet.ciiva.com/7746/443971-7746495.pdf?src-supplier=Element14; ComponentLink5Description: https://datasheet.ciiva.com/7746/443971-7746495.pdf?src-supplier=Element14
R?#17 = RC0805FR-07510RL: Fixed Resistor, Metal Glaze/thick Film, 0.125W, 510ohm, 150V, 1% +/-Tol, 100ppm/Cel, Surface Mount, 0805; Manufacturer: Yageo; Additional Feature: LASER TRIMMABLE; Power: 125mW; Rated Temperature: 70°C; Value: 510R; Temperature Coefficient (ppm/Cel): 100; Package Height: 0.5mm; Package Length: 2mm; Package Width: 1.25mm; Supplier: Digikey; Supplier Part Number: 311-510CRCT-ND; Manufacturer Part Number: RC0805FR-07510RL; RoHS: Yes; Category: Chip SMD Resistors; Stock: 68484; Pricing: 1=0.1, 10=0.013, 100=0.0102, 1000=0.00714, 2500=0.00686 (USD); Mounting Technology: Surface Mount; Pins: 2; Package Shape: Rectangular; Case/Package: 0805; Terminal Finish: Nickel; Min Operating Temperature: -55°C; Max Operating Temperature: 155°C; Tolerance: 1%; JESD-609 Code: e3; Resistor Type: FIXED RESISTOR; Construction: Chip; Packaging: Tape and Reel; Technology: METAL GLAZE/THICK FILM; Termination: Wraparound; Working Voltage: 150V; Reach SVHC Compliant: Yes; RoHS Compliant: Yes; ComponentLink1URL: https://datasheet.ciiva.com:443/pdfs/VipMasterIC/IC/YAGO/YAGO-S-A0008145938/YAGO-S-A0008145938-1.pdf?src-supplier=IHS+Markit; ComponentLink1Description: https://datasheet.ciiva.com:443/pdfs/VipMasterIC/IC/YAGO/YAGO-S-A0008145938/YAGO-S-A0008145938-1.pdf?src-supplier=IHS+Markit; ComponentLink2URL: https://datasheet.ciiva.com/11808/0900766b8106beab-11808617.pdf?src-supplier=Rs; ComponentLink2Description: https://datasheet.ciiva.com/11808/0900766b8106beab-11808617.pdf?src-supplier=Rs; ComponentLink3URL: https://datasheet.ciiva.com/5558/rc0805-5558264.pdf?src-supplier=Mouser; ComponentLink3Description: https://datasheet.ciiva.com/5558/rc0805-5558264.pdf?src-supplier=Mouser; ComponentLink4URL: https://datasheet.ciiva.com/17419/rc0805-17419942.pdf?src-supplier=Future+Electronics; ComponentLink4Description: https://datasheet.ciiva.com/17419/rc0805-17419942.pdf?src-supplier=Future+Electronics
U?#1 = ADF5901WCCPZ: Telecom Circuit, 1-Func; Manufacturer: Analog Devices; Throw Configuration: ANALOG CIRCUIT; Channels: 1; Max Supply Voltage: 3.465V; Min Supply Voltage: 3.135V; Nominal Supply Voltage: 3.3V; Time @ Peak Reflow Temperature-Max (s): 30s; Supplier: Digikey; Supplier Part Number: ADF5901WCCPZ-ND; Manufacturer Part Number: ADF5901WCCPZ; RoHS: Yes; Category: RF Receivers, Transceivers; Stock: 53; Pricing: 1=45.23, 19=32.46263 (USD); Case/Package: HVQCCN; Pins: 32; Package Shape: Square; Terminal Finish: Tin; Min Operating Temperature: -40°C; Max Operating Temperature: 105°C; JESD-609 Code: e3; JESD-30 Code: S-XQCC-N32; Moisture Sensitivity Level: 3; Package Style: CHIP CARRIER, HEAT SINK/SLUG, VERY THIN PROFILEMeter; Peak Reflow Temperature (Cel): 260°C; Surface Mount: Yes; Terminal Form: No Lead; Terminal Position: QUAD; Length: 5mm; Width: 5mm; Height - Seated (Max): 0.8mm; Terminal Pitch: 0.5mm; Reach SVHC Compliant: Yes; RoHS Compliant: Yes; Temperature Grade: INDUSTRIAL; ComponentLink1URL: https://datasheet.ciiva.com:443/pdfs/VipMasterIC/IC/ANDI/ANDI-S-A0004584065/ANDI-S-A0004584065-1.pdf?src-supplier=IHS+Markit; ComponentLink1Description: https://datasheet.ciiva.com:443/pdfs/VipMasterIC/IC/ANDI/ANDI-S-A0004584065/ANDI-S-A0004584065-1.pdf?src-supplier=IHS+Markit; ComponentLink2URL: https://datasheet.octopart.com/ADF5901WCCPZ-Analog-Devices-datasheet-66325438.pdf?src-supplier=Element14; ComponentLink2Description: https://datasheet.octopart.com/ADF5901WCCPZ-Analog-Devices-datasheet-66325438.pdf?src-supplier=Element14; ComponentLink3URL: https://www.analog.com/media/en/technical-documentation/data-sheets/ADF5901.pdf?src-supplier=Digikey; ComponentLink3Description: https://www.analog.com/media/en/technical-documentation/data-sheets/ADF5901.pdf?src-supplier=Digikey
U?#2 = ADF4159CCPZ-RL7: Phase Detector, BICMOS, PQCC24; Manufacturer: Analog Devices; Package Body Material: Plastic; Package Equivalence Code: LCC24,.16SQ,20; Power Supplies: 1.8,3/3.3V; Supply Current-Max (Isup): 40mA; Qualification Status: Not Qualified; Supplier: Digikey; Supplier Part Number: ADF4159CCPZ-RL7CT-ND; Manufacturer Part Number: ADF4159CCPZ-RL7; RoHS: Yes; Category: Clock Generators, PLLs, Frequency Synthesizers; Stock: 2721; Pricing: 1=20.87, 10=14.857, 25=13.2904, 100=12.1125 (USD); Case/Package: QCCN; Pins: 24; Package Shape: Square; Terminal Finish: Tin; Min Operating Temperature: -40°C; Max Operating Temperature: 125°C; JESD-609 Code: e3; Throw Configuration: PHASE DETECTOR; Moisture Sensitivity Level: 3; Package Style: CHIP CARRIERMeter; Peak Reflow Temperature (Cel): 260°C; Surface Mount: Yes; Technology: BICMOS; Terminal Form: No Lead; Terminal Position: QUAD; Terminal Pitch: 0.5mm; Temperature Grade: AUTOMOTIVE; Reach SVHC Compliant: Yes; RoHS Compliant: Yes; ComponentLink1URL: https://datasheet.ciiva.com:443/pdfs/VipMasterIC/IC/ANDI/ANDIS20486/ANDIS20486-1.pdf?src-supplier=IHS+Markit; ComponentLink1Description: https://datasheet.ciiva.com:443/pdfs/VipMasterIC/IC/ANDI/ANDIS20486/ANDIS20486-1.pdf?src-supplier=IHS+Markit; ComponentLink2URL: http://components.arrow.com/part/dataview/56351364S549242N2771?src-supplier=Arrow+Electronics; ComponentLink2Description: http://components.arrow.com/part/dataview/56351364S549242N2771?src-supplier=Arrow+Electronics; ComponentLink3URL: http://www.mouser.com/ds/2/609/ADF4159-878383.pdf?src-supplier=Mouser; ComponentLink3Description: http://www.mouser.com/ds/2/609/ADF4159-878383.pdf?src-supplier=Mouser; ComponentLink4URL: http://www.analog.com/static/imported-files/data_sheets/ADF4159.pdf?src-supplier=Avnet; ComponentLink4Description: http://www.analog.com/static/imported-files/data_sheets/ADF4159.pdf?src-supplier=Avnet; ComponentLink5URL: https://www.analog.com/media/en/technical-documentation/data-sheets/ADF4159.pdf?src-supplier=Digikey; ComponentLink5Description: https://www.analog.com/media/en/technical-documentation/data-sheets/ADF4159.pdf?src-supplier=Digikey; ComponentLink6URL: https://datasheet.octopart.com/ADF4159CCPZ-RL7-Analog-Devices-datasheet-28359207.pdf?src-supplier=Newark; ComponentLink6Description: https://datasheet.octopart.com/ADF4159CCPZ-RL7-Analog-Devices-datasheet-28359207.pdf?src-supplier=Newark; ComponentLink7URL: https://datasheet.octopart.com/ADF4159CCPZ-RL7-Analog-Devices-datasheet-140566762.pdf?src-supplier=Arrow.cn; ComponentLink7Description: https://datasheet.octopart.com/ADF4159CCPZ-RL7-Analog-Devices-datasheet-140566762.pdf?src-supplier=Arrow.cn